# Altium project IMU_Board.PrjPcb
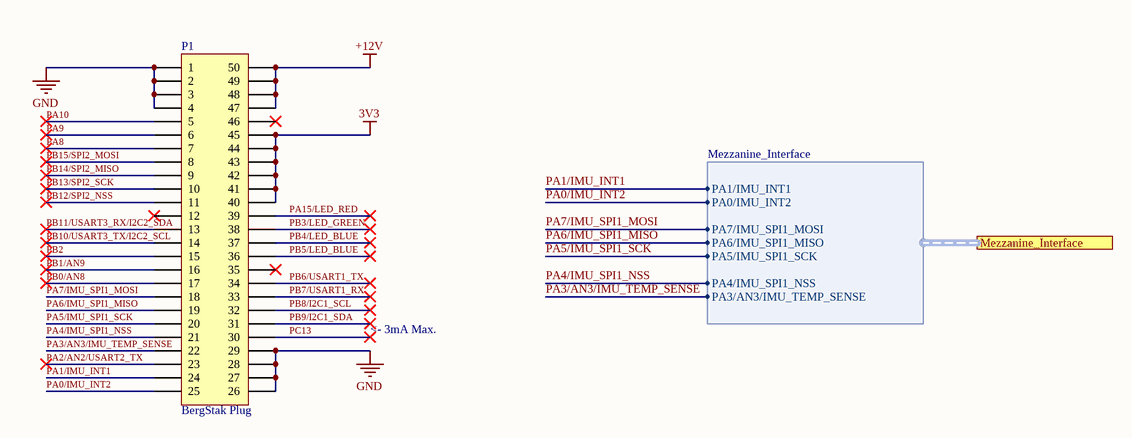
[diagram p0: Controller_Board_Interface.SchDoc]
ProjectAuthor: George Mardari; ProjectRevision: 1.7
2 sheets, 25 parts. Net scope: flat (ports and power ports of the same name join across sheets).
Board file: IMU_Board.PcbDoc
Sheets:
  Controller_Board_Interface.SchDoc
  IMU_Board.SchDoc

## Sheet Controller_Board_Interface.SchDoc: IMU Controller Board Interface
size Letter; DocumentNumber: 1; Revision: 1.3; SheetNumber: 1; SheetTotal: 2; Website: www.uwmidsun.com

### Parts
P1  Series: BergStak Plug  [CONN, Bergstak 50 Pos Plug]  (hidden comment: CONN 50POS Bergstak Plug 0.02")

### Ports
Mezzanine_Interface (harness Mezzanine_Interface)

### Harnesses
Mezzanine_Interface: PA1/IMU_INT1, PA0/IMU_INT2, PA7/IMU_SPI1_MOSI, PA6/IMU_SPI1_MISO, PA5/IMU_SPI1_SCK, PA4/IMU_SPI1_NSS, PA3/AN3/IMU_TEMP_SENSE

### Nets
3V3: P1.40 P1.41 P1.42 P1.43 P1.44 P1.45
+12V: P1.47 P1.48 P1.49 P1.50
GND: P1.1 P1.2 P1.3 P1.4 P1.26 P1.27 P1.28 P1.29
PA0/IMU_INT2: P1.25 ; port Mezzanine_Interface.PA0/IMU_INT2
PA1/IMU_INT1: P1.24 ; port Mezzanine_Interface.PA1/IMU_INT1
PA2/AN2/USART2_TX: P1.23  [project net PA2/AN2/USART2_TX_1]
PA3/AN3/IMU_TEMP_SENSE: P1.22 ; port Mezzanine_Interface.PA3/AN3/IMU_TEMP_SENSE
PA4/IMU_SPI1_NSS: P1.21 ; port Mezzanine_Interface.PA4/IMU_SPI1_NSS
PA5/IMU_SPI1_SCK: P1.20 ; port Mezzanine_Interface.PA5/IMU_SPI1_SCK
PA6/IMU_SPI1_MISO: P1.19 ; port Mezzanine_Interface.PA6/IMU_SPI1_MISO
PA7/IMU_SPI1_MOSI: P1.18 ; port Mezzanine_Interface.PA7/IMU_SPI1_MOSI
PA8: P1.7  [project net PA8_1]
PA9: P1.6  [project net PA9_1]
PA10: P1.5  [project net PA10_1]
PA15/LED_RED: P1.39  [project net PA15/LED_RED_1]
PB0/AN8: P1.17  [project net PB0/AN8_1]
PB1/AN9: P1.16  [project net PB1/AN9_1]
PB2: P1.15  [project net PB2_1]
PB3/LED_GREEN: P1.38  [project net PB3/LED_GREEN_1]
PB4/LED_BLUE: P1.37  [project net PB4/LED_BLUE_1]
PB5/LED_BLUE: P1.36  [project net PB5/LED_BLUE_1]
PB6/USART1_TX: P1.34  [project net PB6/USART1_TX_1]
PB7/USART1_RX: P1.33  [project net PB7/USART1_RX_1]
PB8/I2C1_SCL: P1.32  [project net PB8/I2C1_SCL_1]
PB9/I2C1_SDA: P1.31  [project net PB9/I2C1_SDA_1]
PB10/USART3_TX/I2C2_SCL: P1.14  [project net PB10/USART3_TX/I2C2_SCL_1]
PB11/USART3_RX/I2C2_SDA: P1.13  [project net PB11/USART3_RX/I2C2_SDA_1]
PB12/SPI2_NSS: P1.11  [project net PB12/SPI2_NSS_1]
PB13/SPI2_SCK: P1.10  [project net PB13/SPI2_SCK_1]
PB14/SPI2_MISO: P1.9  [project net PB14/SPI2_MISO_1]
PB15/SPI2_MOSI: P1.8  [project net PB15/SPI2_MOSI_1]
PC13: P1.30  [project net PC13_1]

Not connected (* = marked no-connect by the designer): P1 12* 35* 46*

### Notes on the sheet
- <- 3mA Max.
- Project:
- Title:
- Size:
- Project Lead:
- Letter
- Revision:
- University of Waterloo
- 200 University Ave W
- Waterloo, ON, Canada
- N2L 3E9
- Date:
- Sheet
- of
- Website:

### Library data of the parts
P1 = CONN 50POS Bergstak Plug 0.02": 50 Position Connector Plug, Outer Shroud Contacts Surface Mount Gold; Manufacturer 1: Amphenol FCI; Manufacturer Part Number 1: 10132797-055100LF; Number of Positions: 50; Mated Stacking Heights: 5mm; Pitch: 0.020" (0.50mm); Supplier 1: Digi-Key; Supplier Part Number 1: 609-5226-1-ND; Packaging: Cut Tape (CT); Part Status: Active; Connector Type: Plug, Outer Shroud Contacts; Number of Rows: 2; Mounting Type: Surface Mount; Contact Finish: Gold; Contact Finish Thickness: 1µin (0.025µm); Height Above Board: 0.169" (4.30mm); ComponentLink1URL: http://portal.fciconnect.com/Comergent//fci/drawing/10132797.pdf; ComponentLink1Description: http://portal.fciconnect.com/Comergent//fci/drawing/10132797.pdf

## Sheet IMU_Board.SchDoc: IMU Board
size Letter; DocumentNumber: 2; Revision: 1.3; SheetNumber: 2; SheetTotal: 2; Website: www.uwmidsun.com
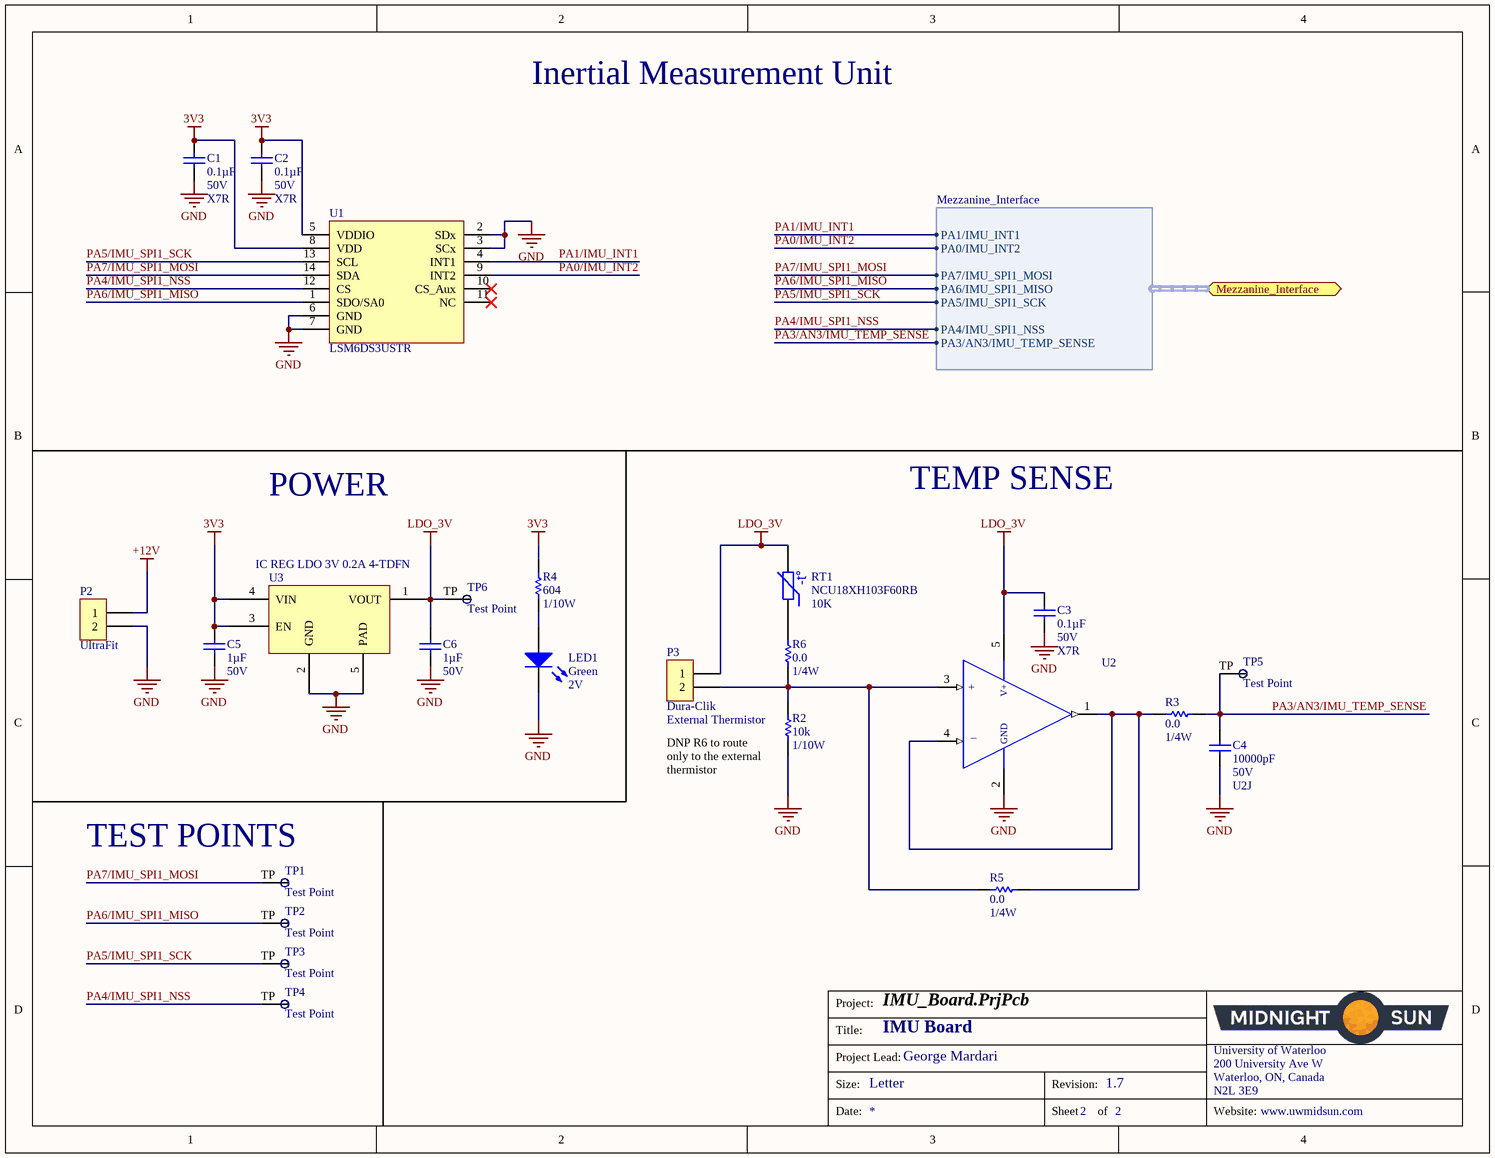
[diagram p1: IMU_Board.SchDoc]

### Parts
C1  Capacitance: 0.1µF  Voltage: 50V  Temperature Coefficient: X7R  [CAP, 0603]  (hidden comment: CAP CER 0.1UF 50V 10% X7R 0603)
C2  Capacitance: 0.1µF  Voltage: 50V  Temperature Coefficient: X7R  [CAP, 0603]  (hidden comment: CAP CER 0.1UF 50V 10% X7R 0603)
C3  Capacitance: 0.1µF  Voltage: 50V  Temperature Coefficient: X7R  [CAP, 0603]  (hidden comment: CAP CER 0.1UF 50V 10% X7R 0603)
C4  Capacitance: 10000pF  Voltage: 50V  Temperature Coefficient: U2J  [CAP, 0603]  (hidden comment: CAP CER 10nF 50V 5% X7R 0603)
C5  Capacitance: 1µF  Voltage: 50V  [CAP, 0603]  (hidden comment: CAP CER 1UF 50V 10% X7R 0603)
C6  Capacitance: 1µF  Voltage: 50V  [CAP, 0603]  (hidden comment: CAP CER 1UF 50V 10% X7R 0603)
LED1  Color: Green  Voltage - Forward (Vf) (Typ): 2V  [LED_0603]  (hidden comment: LED GREEN CLEAR 2V 0603)
P2  Series: UltraFit  [CONN, 2POS ULTRA-FIT]  (hidden comment: CONN 2POS ULTRA-FIT 0.138")
P3  Dura-Clik  [CONN, 2POS Dura-Click Vertical]
R2  Resistance: 10k  Power: 1/10W  [RES, 0603]  (hidden comment: RES 10K OHM 1% 1/10W 0603)
R3  Resistance: 0.0  Power (Watts): 1/4W  [RES, 0603]  (hidden comment: RES 0.0 OHM 1/4W 0603)
R4  Resistance: 604  Power: 1/10W  [RES, 0603]  (hidden comment: RES 604 OHM 1% 1/10W 0603)
R5  Resistance: 0.0  Power (Watts): 1/4W  [RES, 0603]  (hidden comment: RES 0.0 OHM 1/4W 0603)  (no BOM)
R6  Resistance: 0.0  Power (Watts): 1/4W  [RES, 0603]  (hidden comment: RES 0.0 OHM 1/4W 0603)
RT1  Manufacturer Part Number: NCU18XH103F60RB  Resistance: 10K  [RES, 0603]  (hidden comment: NTC THERMISTORS 10K 0603 SMD)
TP1  Test Point  [Test Point]
TP2  Test Point  [Test Point]
TP3  Test Point  [Test Point]
TP4  Test Point  [Test Point]
TP5  Test Point  [Test Point]
TP6  Test Point  [Test Point]
U1  Manufacturer Part Number: LSM6DS3USTR  [IC SENSOR IMU LGA-14L]  (hidden comment: IC SENSOR IMU LGA-14L)
U2  IC OP AMP GEN PURPOSE RR 10MHZ SOT-23-5  [IC OP AMP GP RR 10MHZ SOT-23-5]  (value not drawn)
U3  IC REG LDO 3V 0.2A 4-TDFN  [IC REG LDO 3V 0.2A 4-TDFN]

### Ports
Mezzanine_Interface (harness Mezzanine_Interface)

### Harnesses
Mezzanine_Interface: PA1/IMU_INT1, PA0/IMU_INT2, PA7/IMU_SPI1_MOSI, PA6/IMU_SPI1_MISO, PA5/IMU_SPI1_SCK, PA4/IMU_SPI1_NSS, PA3/AN3/IMU_TEMP_SENSE

### Nets
3V3: C1.1 C2.1 C5.1 R4.1 U1.5(VDDIO) U1.8(VDD) U3.3(EN) U3.4(VIN)
+12V: P2.1
GND: C1.2 C2.2 C3.2 C4.2 C5.2 C6.2 LED1.2(K) P2.2 R2.1 U1.2(SDx) U1.3(SCx) U1.6(GND) U1.7(GND) U2.2(VSS) U3.2(GND) U3.5(PAD)
LDO_3V: C3.1 C6.1 P3.1 RT1.2 TP6.TP U2.5(VDD) U3.1(VOUT)
PA0/IMU_INT2: U1.9(INT2) ; port Mezzanine_Interface.PA0/IMU_INT2
PA1/IMU_INT1: U1.4(INT1) ; port Mezzanine_Interface.PA1/IMU_INT1
PA3/AN3/IMU_TEMP_SENSE: C4.1 R3.2 TP5.TP ; port Mezzanine_Interface.PA3/AN3/IMU_TEMP_SENSE
PA4/IMU_SPI1_NSS: TP4.TP U1.12(CS) ; port Mezzanine_Interface.PA4/IMU_SPI1_NSS
PA5/IMU_SPI1_SCK: TP3.TP U1.13(SCL) ; port Mezzanine_Interface.PA5/IMU_SPI1_SCK
PA6/IMU_SPI1_MISO: TP2.TP U1.1(SDO/SA0) ; port Mezzanine_Interface.PA6/IMU_SPI1_MISO
PA7/IMU_SPI1_MOSI: TP1.TP U1.14(SDA) ; port Mezzanine_Interface.PA7/IMU_SPI1_MOSI
NetLED1_1: LED1.1(A) R4.2
NetP3_2: P3.2 R2.2 R5.1 R6.2 U2.3(+IN)
NetR3_1: R3.1 R5.2 U2.1(OUTPUT) U2.4(-IN)
NetR6_1: R6.1 RT1.1

Not connected (* = marked no-connect by the designer): U1 10(CS_Aux)* 11(NC)*

### Notes on the sheet
- Inertial Measurement Unit
- POWER
- TEMP SENSE
- (near R2) External Thermistor
- (near R2) DNP R6 to route only to the external thermistor
- (near TP1) TEST POINTS
- Project:
- Title:
- Size:
- Project Lead:
- Letter
- Revision:
- University of Waterloo
- 200 University Ave W
- Waterloo, ON, Canada
- N2L 3E9
- Date:
- Sheet
- of
- Website:
- (in symbol IC OP AMP GEN PURPOSE RR 10MHZ SOT-23-5) V+; +; GND; _
- (in symbol NTC THERMISTORS 10K 0603 SMD) -t°

### Library data of the parts
C1-C3 = CAP CER 0.1UF 50V 10% X7R 0603: 0.10µF ±10% 50V Ceramic Capacitor X7R 0603 (1608 Metric); Manufacturer 1: AVX Corporation; Manufacturer Part Number 1: 06035C104KAT2A; Supplier 1: Digi-Key; Supplier Part Number 1: 478-5052-1-ND; Packaging: Cut Tape (CT); Part Status: Active; Operating Temperature: -55°C ~ 125°C; Ratings: -; Mounting Type: Surface Mount, MLCC; Package / Case: 0603 (1608 Metric); Size / Dimension: 0.063" L x 0.032" W (1.60mm x 0.81mm); Height - Seated (Max): -; Thickness (Max): 0.035" (0.90mm); Lead Spacing: -; Lead Style: -; ComponentLink1URL: http://datasheets.avx.com/X7RDielectric.pdf; ComponentLink1Description: http://datasheets.avx.com/X7RDielectric.pdf; Tolerance: ±10%
C4 = CAP CER 10nF 50V 5% X7R 0603: 10000pF ±5% 50V Ceramic Capacitor U2J 0603 (1608 Metric); Manufacturer 1: KEMET; Manufacturer Part Number 1: C0603C103J5JAC7867; Supplier 1: Digi-Key; Supplier Part Number 1: 399-13384-1-ND; Packaging: Cut Tape (CT); Part Status: Active; Operating Temperature: -55°C ~ 125°C; Ratings: -; Failure Rate: -; Mounting Type: Surface Mount, MLCC; Package / Case: 0603 (1608 Metric); Size / Dimension: 0.063" L x 0.032" W (1.60mm x 0.80mm); Height - Seated (Max): -; Thickness (Max): 0.034" (0.87mm); Lead Spacing: -; Lead Style: -; ComponentLink1URL: http://www.kemet.com/docfinder?Partnumber=C0603C103J5JAC7867; ComponentLink1Description: http://www.kemet.com/docfinder?Partnumber=C0603C103J5JAC7867; Tolerance: ±5%
C5 C6 = CAP CER 1UF 50V 10% X7R 0603: 1µF ±10% 50V Ceramic Capacitor X7R 0603 (1608 Metric); Manufacturer 1: Taiyo Yuden; Manufacturer Part Number 1: UMK107AB7105KA-T; Supplier 1: Digi-Key; Supplier Part Number 1: 587-3247-1-ND; Packaging: Cut Tape (CT); Part Status: Active; Operating Temperature: -55°C ~ 125°C; Ratings: -; Mounting Type: Surface Mount, MLCC; Package / Case: 0603 (1608 Metric); Size / Dimension: 0.063" L x 0.031" W (1.60mm x 0.80mm); Height - Seated (Max): -; Thickness (Max): 0.037" (0.95mm); Lead Spacing: -; Lead Style: -; ComponentLink1URL: http://www.yuden.co.jp/productdata/catalog/en/mlcc_all_e.pdf; ComponentLink1Description: http://www.yuden.co.jp/productdata/catalog/en/mlcc_all_e.pdf; Tolerance: ±10%
LED1 = LED GREEN CLEAR 2V 0603: Green 572nm LED Indication - Discrete 2V 0603 (1608 Metric); Manufacturer: Wurth Electronics Inc.; Manufacturer Part Number: 150060VS75000; Lens Color: Colorless; Millicandela Rating: 40mcd; Lens Style/Size: Rectangle with Flat Top, 1.10mm x 0.70mm; Current - Test: 20mA; Viewing Angle: 140°; Wavelength - Dominant: 570nm; Supplier 1: Digi-Key; RoHS: RoHS Compliant; Category: Optoelectronics; Stock 1: 9408; Pricing 1: 1=0.21, 100=0.1617, 500=0.13964 (CAD); Packaging: Cut Tape (CT); Part Status: Active; Lens Transparency: Clear; Mounting Type: Surface Mount; Wavelength - Peak: 572nm; Features: -; Package / Case: 0603 (1608 Metric); Supplier Device Package: 0603; Size / Dimension: 1.60mm L x 0.80mm W; Height (Max): 0.80mm; ComponentLink1URL: http://katalog.we-online.de/led/datasheet/150060VS75000.pdf; ComponentLink1Description: http://katalog.we-online.de/led/datasheet/150060VS75000.pdf; Supplier Part Number 1: 732-4980-1-ND
P2 = CONN 2POS ULTRA-FIT 0.138": 2 Positions Header, Shrouded Connector 0.138" (3.50mm) Through Hole Gold; Manufacturer 1: Molex, LLC; Manufacturer Part Number 1: 1722861302; Style: Board to Board or Cable; Shrouding: Shrouded - 4 Wall; Number of Positions: 2; Number of Positions Loaded: All; Contact Length - Post: 0.126" (3.20mm); Material Flammability Rating: UL94 V-0; Mated Stacking Heights: 26.99mm; Voltage: 400V; Supplier 1: Digi-Key; Supplier Part Number 1: WM11673-ND; Packaging: Tray; Part Status: Active; Connector Type: Header; Contact Type: Male Pin; Pitch - Mating: 0.138" (3.50mm); Number of Rows: 1; Row Spacing - Mating: -; Mounting Type: Through Hole; Termination: Kinked Pin, Solder; Fastening Type: Latch Holder; Contact Length - Mating: -; Overall Contact Length: -; Insulation Height: 0.465" (11.80mm); Contact Shape: Square; Contact Finish - Mating: Gold; Contact Finish Thickness - Mating: 30µin (0.76µm); Contact Finish - Post: Tin; Contact Material: Copper Alloy; Insulation Material: Liquid Crystal Polymer (LCP); Operating Temperature: -40°C ~ 120°C; Ingress Protection: -; Insulation Color: Black; Current Rating: -; Contact Finish Thickness - Post: 60µin (1.52µm); ComponentLink1URL: http://www.molex.com/pdm_docs/sd/1722861302_sd.pdf; ComponentLink1Description: http://www.molex.com/pdm_docs/sd/1722861302_sd.pdf
P3 = CONN 2POS DURA-CLIK 0.079" VERT: 2 Positions Header, Shrouded Connector 0.079" (2.00mm) Surface Mount, Vertical Tin; Manufacturer: Molex, LLC; Manufacturer Part Number: 5600200220; Style: Board to Cable/Wire; Shrouding: Shrouded - 4 Wall; Number of Positions: 2; Number of Positions Loaded: All; Mated Stacking Heights: 9.3mm; Supplier 1: Digi-Key; Supplier Part Number 1: WM10862CT-ND; Packaging: Cut Tape (CT); Part Status: Active; Connector Type: Header; Contact Type: Male Pin; Number of Rows: 1; Row Spacing - Mating: -; Mounting Type: Surface Mount; Termination: Solder; Fastening Type: Latch Lock; Contact Length - Mating: -; Contact Length - Post: -; Overall Contact Length: -; Insulation Height: 0.315" (8.00mm); Contact Shape: Square; Contact Finish - Mating: Tin; Contact Finish Thickness - Mating: -; Contact Finish - Post: Tin; Contact Material: Copper Alloy; Insulation Material: Polyamide (PA), Nylon; Operating Temperature: -; Ingress Protection: -; Material Flammability Rating: -; Insulation Color: Natural; Current Rating: -; Contact Finish Thickness - Post: -; ComponentLink1URL: http://www.molex.com/pdm_docs/sd/5600200220_sd.pdf; ComponentLink1Description: http://www.molex.com/pdm_docs/sd/5600200220_sd.pdf; Pitch - Mating: 0.079" (2.00mm); RoHS: RoHS Compliant; Category: Connectors, Interconnects; Stock 1: 11912; Pricing 1: 1=1.16, 10=1.012, 25=0.952, 50=0.9122, 100=0.8727, 250=0.79336 (CAD); Features: Solder Retention; Voltage Rating: -; Applications: Automotive, Industrial
R2 = RES 10K OHM 1% 1/10W 0603: RES SMD 10K OHM 1% 1/10W 0603; Manufacturer 1: Yageo; Manufacturer Part Number 1: RC0603FR-0710KL; Temperature Coefficient: ±100ppm/°C; Supplier 1: Digi-Key; Supplier Part Number 1: 311-10.0KHRCT-ND; Packaging: Cut Tape (CT); Part Status: Active; Composition: Thick Film; Operating Temperature: -55°C ~ 155°C; Package / Case: 0603 (1608 Metric); Supplier Device Package: 0603; Size / Dimension: 0.063" L x 0.031" W (1.60mm x 0.80mm); Height - Seated (Max): 0.022" (0.55mm); Failure Rate: -; ComponentLink1URL: http://www.yageo.com/documents/recent/PYu-RC_Group_51_RoHS_L_7.pdf; ComponentLink1Description: http://www.yageo.com/documents/recent/PYu-RC_Group_51_RoHS_L_7.pdf; Tolerance: ±1%
R3 R5 R6 = RES 0.0 OHM 1/4W 0603: RES SMD 0.0 OHM JUMPER 1/4W 0603; Manufacturer 1: Vishay Dale; Manufacturer Part Number 1: CRCW06030000Z0EAHP; Supplier 1: Digi-Key; Supplier Part Number 1: 541-0.0SBCT-ND; Packaging: Cut Tape (CT); Part Status: Active; Composition: Thick Film; Operating Temperature: -55°C ~ 155°C; Package / Case: 0603 (1608 Metric); Supplier Device Package: 0603; Size / Dimension: 0.063" L x 0.033" W (1.60mm x 0.85mm); Height - Seated (Max): 0.022" (0.55mm); Failure Rate: -; ComponentLink1URL: http://www.vishay.com/docs/20043/crcwhpe3.pdf; ComponentLink1Description: http://www.vishay.com/docs/20043/crcwhpe3.pdf
R4 = RES 604 OHM 1% 1/10W 0603: RES SMD 604 OHM 1% 1/10W 0603; Manufacturer 1: Yageo; Manufacturer Part Number 1: RC0603FR-07604RL; Temperature Coefficient: ±100ppm/°C; Supplier 1: Digi-Key; Supplier Part Number 1: 311-604HRCT-ND; Packaging: Cut Tape (CT); Part Status: Active; Composition: Thick Film; Operating Temperature: -55°C ~ 155°C; Package / Case: 0603 (1608 Metric); Supplier Device Package: 0603; Size / Dimension: 0.063" L x 0.031" W (1.60mm x 0.80mm); Height - Seated (Max): 0.022" (0.55mm); Failure Rate: -; ComponentLink1URL: http://www.yageo.com/documents/recent/PYu-RC_Group_51_RoHS_L_7.pdf; ComponentLink1Description: http://www.yageo.com/documents/recent/PYu-RC_Group_51_RoHS_L_7.pdf; Tolerance: ±1%
RT1 = NTC THERMISTORS 10K 0603 SMD: NTC THERMISTORS 10KOHM 1608 SMD; Manufacturer: Murata Electronics North America; B Value Tolerance: ±1%; B25/50: 3380K; B25/85: 3434K; B25/100: 3455K; Supplier 1: Digi-Key; RoHS: Request Inventory Verification; Category: Sensors, Transducers; Stock 1: 4000; Pricing 1: 4000=0.06734, 8000=0.05942, 12000=0.05744, 20000=0.05645, 28000=0.05546 (CAD); Packaging: Tape & Reel (TR); Part Status: Active; B0/50: -; B25/75: -; Operating Temperature: -40°C ~ 125°C; Length - Lead Wire: -; Mounting Type: Surface Mount; Package / Case: 0603 (1608 Metric); ComponentLink1URL: https://www.murata.com/~/media/webrenewal/support/library/catalog/products/thermistor/r03e.ashx; ComponentLink1Description: https://www.murata.com/~/media/webrenewal/support/library/catalog/products/thermistor/r03e.ashx
U1 = IC SENSOR IMU LGA-14L: Accelerometer, Gyroscope, 3 Axis Sensor I²C, SPI Output; Manufacturer: STMicroelectronics; Supplier 1: Digi-Key; RoHS: RoHS Compliant; Category: Sensors, Transducers; Stock 1: 23614; Pricing 1: 1=4.3, 10=3.858, 100=3.1606, 500=2.69052, 1000=2.26912 (CAD); Part Status: Active; Sensor Type: Accelerometer, Gyroscope, 3 Axis; Output Type: I²C, SPI; Operating Temperature: -40°C ~ 85°C (TA); ComponentLink1URL: http://www.st.com/content/ccc/resource/technical/document/datasheet/group0/2e/84/27/34/60/8d/49/f2/DM00237513/files/DM00237513.pdf/jcr:content/translations/en.DM00237513.pdf; ComponentLink1Description: http://www.st.com/content/ccc/resource/technical/document/datasheet/group0/2e/84/27/34/60/8d/49/f2/DM00237513/files/DM00237513.pdf/jcr:content/translations/en.DM00237513.pdf; Supplier Part Number 1: 497-16910-1-ND
U2 = IC OP AMP GEN PURPOSE RR 10MHZ SOT-23-5: General Purpose Amplifier 1 Circuit Rail-to-Rail SOT-23-5; Manufacturer 1: Texas Instruments; Manufacturer Part Number 1: TLV316QDBVRQ1; Description 1: IC OP AMP GP RR 10MHZ 5-SOT-23; Number of Circuits: 1; Slew Rate: 6 V/µs; Current - Supply: 400µA; Current - Output / Channel: 50mA; Voltage - Supply, Single/Dual (±): 1.8 V ~ 5.5 V, ±0.9 V ~ 2.75 V; Supplier 1: Digi-Key; Supplier Part Number 1: 296-45323-1-ND; RoHS: RoHS Compliant; Category: Integrated Circuits (ICs); Stock 1: 1747; Pricing 1: 1=1.33, 10=1.185, 100=0.9234, 500=0.76276, 1000=0.60218 (CAD); Packaging: Cut Tape (CT); Part Status: Active; Amplifier Type: General Purpose; Output Type: Rail-to-Rail; -3db Bandwidth: -; Operating Temperature: -40°C ~ 125°C; Mounting Type: Surface Mount; Package / Case: SC-74A, SOT-753; Supplier Device Package: SOT-23-5; ComponentLink1URL: http://www.ti.com/lit/ds/symlink/tlv316-q1.pdf; ComponentLink1Description: http://www.ti.com/lit/ds/symlink/tlv316-q1.pdf
U3 = IC REG LDO 3V 0.2A 4-TDFN: Manufacturer: Microchip Technology; Manufacturer Part Number: MIC94310-PYMT-TR; Regulator Topology: Positive Fixed; Current - Output: 200mA; Voltage - Dropout (Typical): 0.04V @ 200mA; Voltage - Input: Up to 3.6V; Current - Limit (Min): 250mA; Supplier 1: Digi-Key; RoHS: RoHS Compliant; Category: Integrated Circuits (ICs); Stock 1: 4802; Pricing 1: 1=0.45, 25=0.3708, 100=0.3386 (CAD); Packaging: Cut Tape (CT); Part Status: Active; Voltage - Output: 3V; Operating Temperature: -40°C ~ 125°C; Mounting Type: Surface Mount; Package / Case: 4-UFDFN Exposed Pad; Supplier Device Package: 4-TDFN (1.2x1.6); ComponentLink1URL: http://www.microchip.com/mymicrochip/filehandler.aspx?ddocname=en580409; ComponentLink1Description: http://www.microchip.com/mymicrochip/filehandler.aspx?ddocname=en580409

## Nets that join several sheets
3V3: Controller_Board_Interface (6 pins), IMU_Board (8 pins)
+12V: Controller_Board_Interface (P1.47 P1.48 P1.49 P1.50), IMU_Board (P2.1)
GND: Controller_Board_Interface (8 pins), IMU_Board (16 pins)
PA0/IMU_INT2: Controller_Board_Interface (P1.25), IMU_Board (U1.9)
PA1/IMU_INT1: Controller_Board_Interface (P1.24), IMU_Board (U1.4)
PA3/AN3/IMU_TEMP_SENSE: Controller_Board_Interface (P1.22), IMU_Board (C4.1 R3.2 TP5.TP)
PA4/IMU_SPI1_NSS: Controller_Board_Interface (P1.21), IMU_Board (TP4.TP U1.12)
PA5/IMU_SPI1_SCK: Controller_Board_Interface (P1.20), IMU_Board (TP3.TP U1.13)
PA6/IMU_SPI1_MISO: Controller_Board_Interface (P1.19), IMU_Board (TP2.TP U1.1)
PA7/IMU_SPI1_MOSI: Controller_Board_Interface (P1.18), IMU_Board (TP1.TP U1.14)